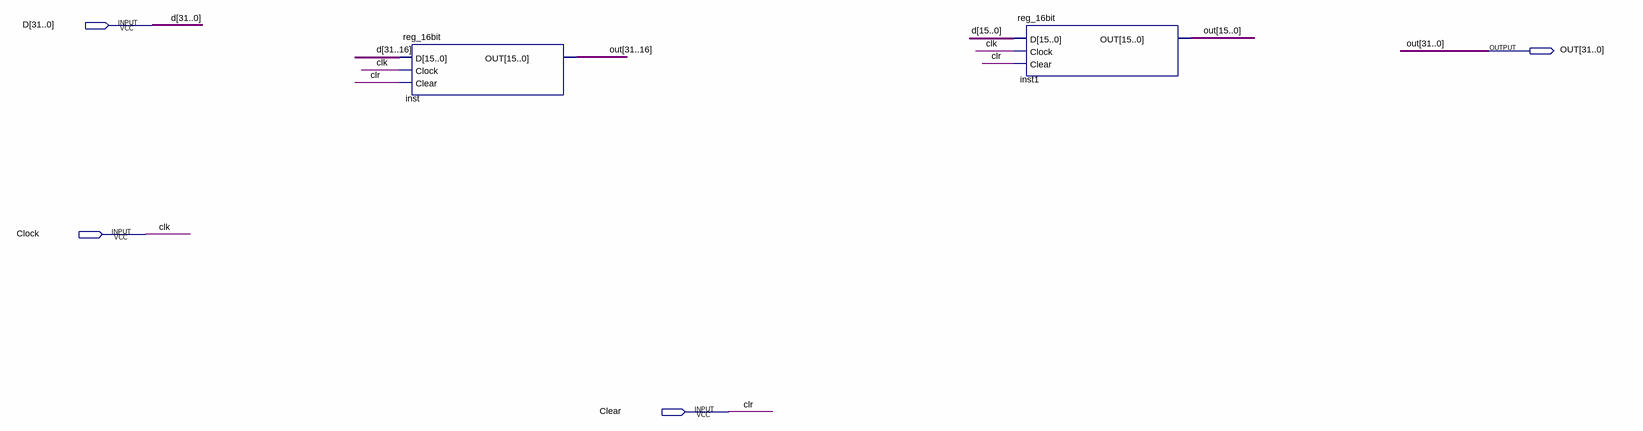
[diagram p0: schematic sheet]
// Quartus schematic reg_32bit.bdf as structural Verilog: 2 symbols, 4 pins
module reg_32bit (
  input  [31:0] D,
  input  Clock,
  input  Clear,
  output [31:0] OUT
);

  reg_16bit inst (.D(D[31:16]), .Clock(Clock), .Clear(Clear), .OUT(OUT[31:16]));
  reg_16bit inst1 (.D(D[15:0]), .Clock(Clock), .Clear(Clear), .OUT(OUT[15:0]));

  // Other names for the same wires on the sheet: clk = Clock; clr = Clear
endmodule
